# Altium schematic sheet STM32-ROMI_Rev_A_0_Title.SchDoc
size A4; Date: 9252020; Author: Kyle R; Organization: Altium Limited; Address1: L3, 12a Rodborough Rd; Address2: Frenchs Forest; Address3: NSW; Address4: Australia 2086; DocumentNumber: 09252020; SheetNumber: 0; SheetTotal: 7; Time: Title Block
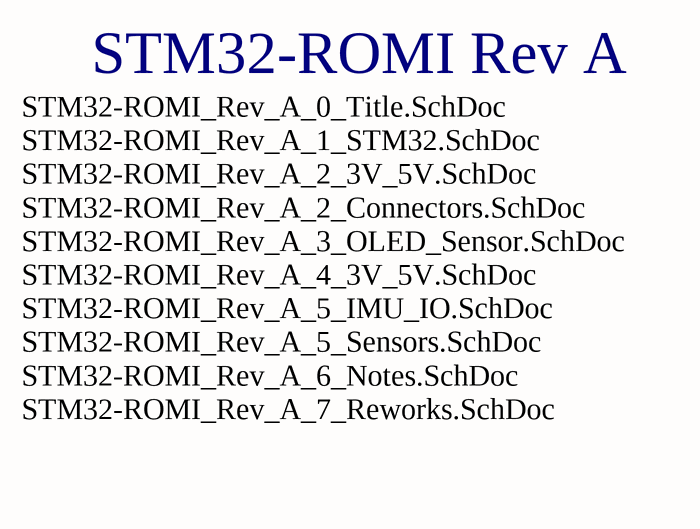
[diagram p0: STM32-ROMI_Rev_A_0_Title.SchDoc]

## Notes on the sheet
- STM32-ROMI Rev A
- STM32-ROMI_Rev_A_0_Title.SchDoc
  STM32-ROMI_Rev_A_1_STM32.SchDoc
  STM32-ROMI_Rev_A_2_3V_5V.SchDoc
  STM32-ROMI_Rev_A_2_Connectors.SchDoc
  STM32-ROMI_Rev_A_3_OLED_Sensor.SchDoc
  STM32-ROMI_Rev_A_4_3V_5V.SchDoc
  STM32-ROMI_Rev_A_5_IMU_IO.SchDoc
  STM32-ROMI_Rev_A_5_Sensors.SchDoc
  STM32-ROMI_Rev_A_6_Notes.SchDoc
  STM32-ROMI_Rev_A_7_Reworks.SchDoc
- Title
- Size:
- Date:
- A4
- Number:
- Time:
- Revision:
- Sheet
- of
- File: